# Altium schematic sheet 0_Overview.SchDoc
size A4; Author: Dennis C. M; CompanyName: Dennis Micro Computers; DrawnBy: Dennis C. M.; SheetNumber: 1; SheetTotal: 5; Size: A4
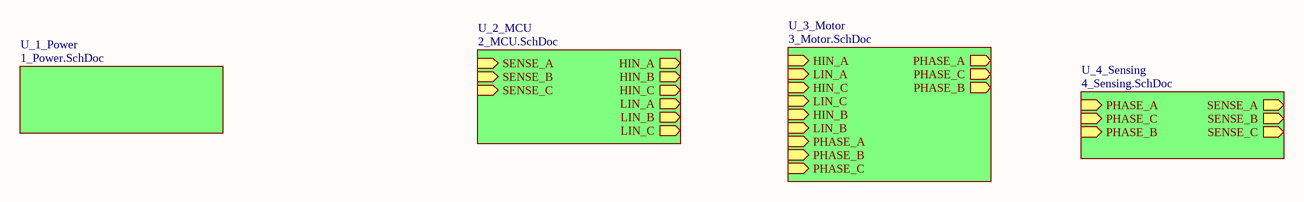
[diagram p0: 0_Overview.SchDoc]

## Sub-sheets
U_1_Power = 1_Power.SchDoc: no entries
U_2_MCU = 2_MCU.SchDoc: HIN_A (out), HIN_B (out), HIN_C (out), LIN_A (out), LIN_B (out), LIN_C (out), SENSE_A (in), SENSE_B (in), SENSE_C (in)
U_3_Motor = 3_Motor.SchDoc: HIN_A (in), LIN_A (in), PHASE_A (out), HIN_C (in), LIN_C (in), PHASE_C (out), HIN_B (in), LIN_B (in), PHASE_B (out), PHASE_A (in), PHASE_B (in), PHASE_C (in)
U_4_Sensing = 4_Sensing.SchDoc: SENSE_A (out), SENSE_B (out), SENSE_C (out), PHASE_A (in), PHASE_C (in), PHASE_B (in)

## Notes on the sheet
- Title
- Company
- Size
- Date:
- A4
- Number
- Sheet
- Revision
- of
- Doc:
- Drawn by: